# EAGLE design power_board_pcie (EAGLE 9.1.3)
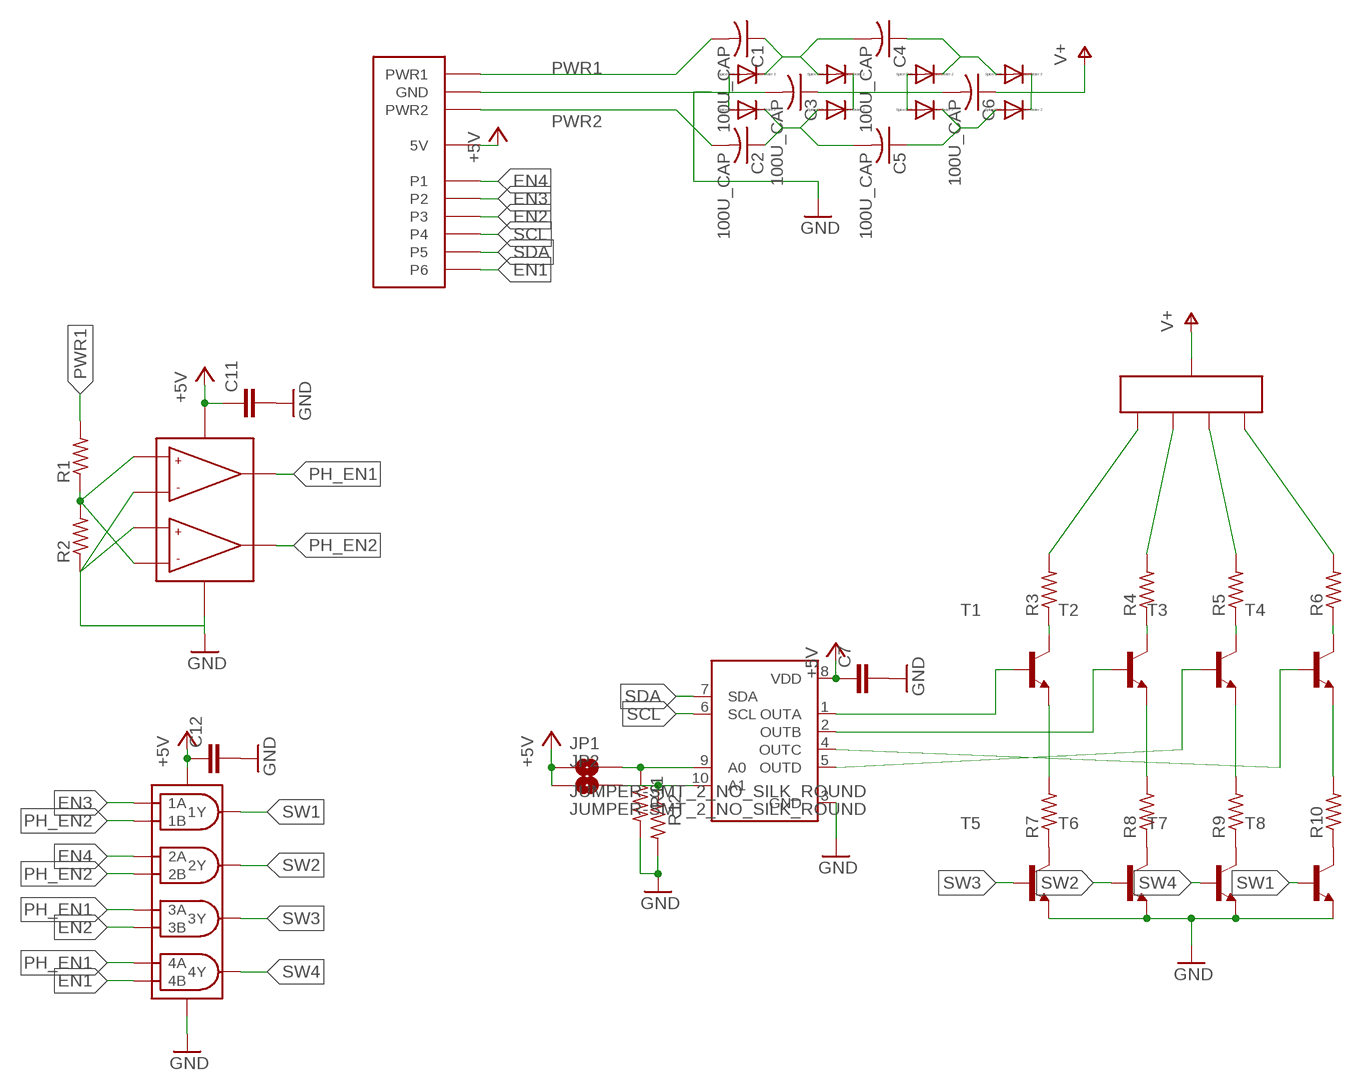
[diagram p0: schematic, sheet 1]

## Parts
C1  100U_CAP  [100U_CAP]
C2  100U_CAP  [100U_CAP]
C3  100U_CAP  [100U_CAP]
C4  100U_CAP  [100U_CAP]
C5  100U_CAP  [100U_CAP]
C6  100U_CAP  [100U_CAP]
C7  C-EUC1206  [C1206]
C11  C-EUC1206  [C1206]
C12  C-EUC1206  [C1206]
D1  BAS16GW  [SOD3616X130]
D2  BAS16GW  [SOD3616X130]
D3  BAS16GW  [SOD3616X130]
D4  BAS16GW  [SOD3616X130]
D5  BAS16GW  [SOD3616X130]
D6  BAS16GW  [SOD3616X130]
D7  BAS16GW  [SOD3616X130]
D8  BAS16GW  [SOD3616X130]
J1  PCIE_EDGE  [PCIE_EDGE]
JP1  JUMPER-SMT_2_NO_SILK_ROUND  [SMT-JUMPER_2_NO_SILK_ROUND]
JP2  JUMPER-SMT_2_NO_SILK_ROUND  [SMT-JUMPER_2_NO_SILK_ROUND]
R1  R-US_R1206  [R1206]
R2  R-US_R1206  [R1206]
R3  R-US_R1206  [R1206]
R4  R-US_R1206  [R1206]
R5  R-US_R1206  [R1206]
R6  R-US_R1206  [R1206]
R7  R-US_R1206  [R1206]
R8  R-US_R1206  [R1206]
R9  R-US_R1206  [R1206]
R10  R-US_R1206  [R1206]
R11  R-US_R0603  [R0603]
R12  R-US_R0603  [R0603]
T1  -NPN-SOT23-EBC  [SOT23-EBC]
T2  -NPN-SOT23-EBC  [SOT23-EBC]
T3  -NPN-SOT23-EBC  [SOT23-EBC]
T4  -NPN-SOT23-EBC  [SOT23-EBC]
T5  -NPN-SOT23-EBC  [SOT23-EBC]
T6  -NPN-SOT23-EBC  [SOT23-EBC]
T7  -NPN-SOT23-EBC  [SOT23-EBC]
T8  -NPN-SOT23-EBC  [SOT23-EBC]
U1  74HCT08D  [SOIC127P600X175-14]
U2  DAC5574  [SOP50P490X110-10]
U3  AZ4558CMTR-G1  [SOIC127P600X175-8]
U$3  POWER_EDGE  [POWER_EDGE]

## Nets
+5V: C7.1 C11.1 C12.1 J1.PWR3(5V) J1.PWR3_2(5V) JP1.1 JP2.1 U1.14(VCC) U2.8(VDD) U3.8(VCC)
EN1: J1.P6 U1.13(4B)
EN2: J1.P3 U1.10(3B)
EN3: J1.P2 U1.1(1A)
EN4: J1.P1 U1.4(2A)
GND: C3.C C7.2 C11.2 C12.2 D1.2(A) D2.2(A) J1.P$2(GND) J1.P$5(GND) R2.1 R11.2 R12.2 T5.E T6.E T7.E T8.E U1.7(GND) U2.3(GND) U3.2(IN1-) U3.4(VEE) U3.5(IN2+)
N$1: R7.2 T1.E
N$2: R1.1 R2.2 U3.3(IN1+) U3.6(IN2-)
N$3: R3.1 T1.C
N$4: C3.A C6.C D3.1(C) D4.1(C) D5.2(A) D6.2(A)
N$5: C1.A C4.C D1.1(C) D3.2(A)
N$6: C2.A C5.C D2.1(C) D4.2(A)
N$7: C4.A D5.1(C) D7.2(A)
N$8: C5.A D6.1(C) D8.2(A)
N$9: R3.2 U$3.C1
N$10: R4.2 U$3.C2
N$11: R5.2 U$3.C3
N$12: R4.1 T2.C
N$13: R6.2 U$3.C4
N$16: R5.1 T3.C
N$18: R6.1 T4.C
N$19: R7.1 T5.C
N$20: T2.B U2.2(OUTB)
N$21: T3.B U2.5(OUTD)
N$22: T4.B U2.4(OUTC)
N$23: T1.B U2.1(OUTA)
N$24: R8.2 T2.E
N$25: R9.2 T3.E
N$26: R10.2 T4.E
N$27: R8.1 T6.C
N$28: R9.1 T7.C
N$29: R10.1 T8.C
N$32: JP1.2 R11.1 U2.9(A0)
N$33: JP2.2 R12.1 U2.10(A1)
PH_EN1: U1.9(3A) U1.12(4A) U3.1(OUT1)
PH_EN2: U1.2(1B) U1.5(2B) U3.7(OUT2)
PWR1: C1.C J1.P$1(PWR1) J1.P$4(PWR1) R1.2
PWR2: C2.C J1.P$3(PWR2) J1.P$6(PWR2)
SCL: J1.P4 U2.6(SCL)
SDA: J1.P5 U2.7(SDA)
SW1: T8.B U1.3(1Y)
SW2: T6.B U1.6(2Y)
SW3: T5.B U1.8(3Y)
SW4: T7.B U1.11(4Y)
V+: C6.A D7.1(C) D8.1(C) U$3.A1(A) U$3.A2(A) U$3.A3(A) U$3.A4(A)

## Library data of the parts
C1-C6 = tide_clock:100U_CAP
C7 C11 C12 = resistor:C-EU: CAPACITOR, European symbol
D1-D8 = tide_clock:BAS16GW
J1 = tide_clock:PCIE_EDGE
JP1 JP2 = SparkFun-Jumpers:JUMPER-SMT_2_NO: Normally open jumper This jumper has two pads in close proximity to each other. Apply solder to close the connection. Round pads are easier to solder for beginners, but are a lot larger. SparkFun Product that uses the round pads: SparkFun EL Sequencer <https://www.sparkfun.com/products/12781>
R1-R12 = resistor:R-US_: RESISTOR, American symbol
T1-T8 = transistor:*-NPN-: NPN Transistror BF959 corrected 2008.03.06
U1 = tide_clock:74HCT08D
U2 = tide_clock:DAC5574
U3 = tide_clock:AZ4558CMTR-G1
U$3 = tide_clock:POWER_EDGE

## Board
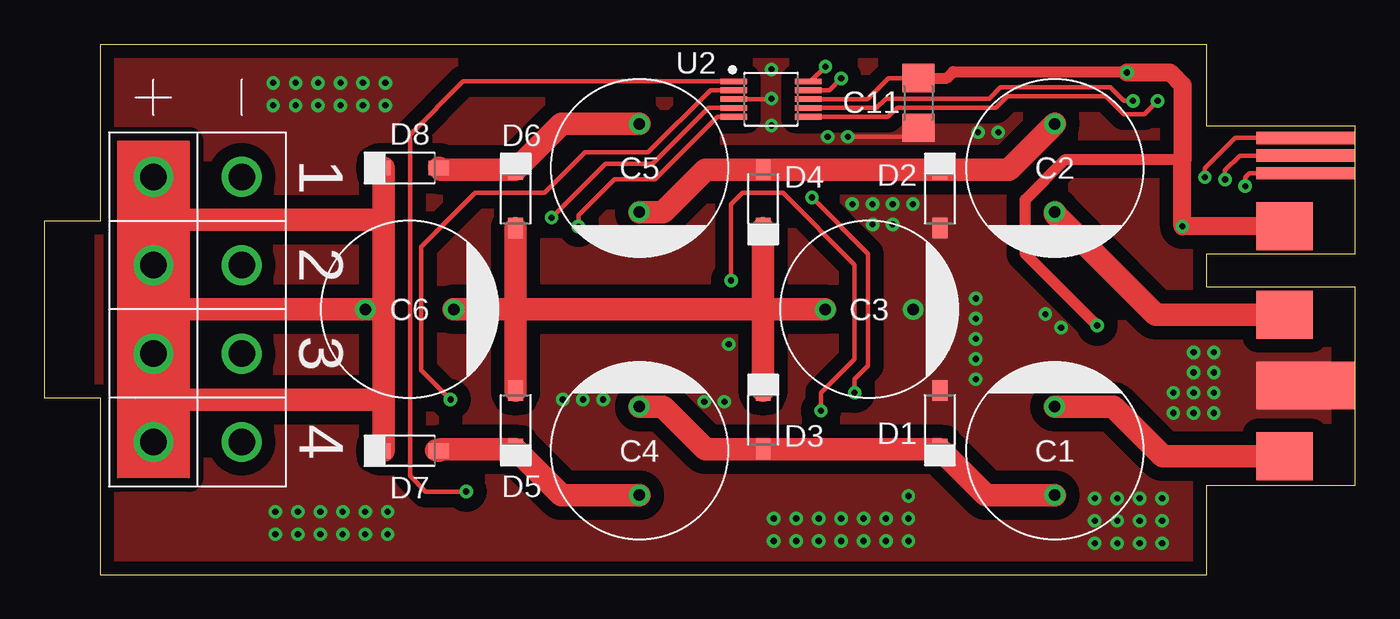
[diagram p1: board, top side]
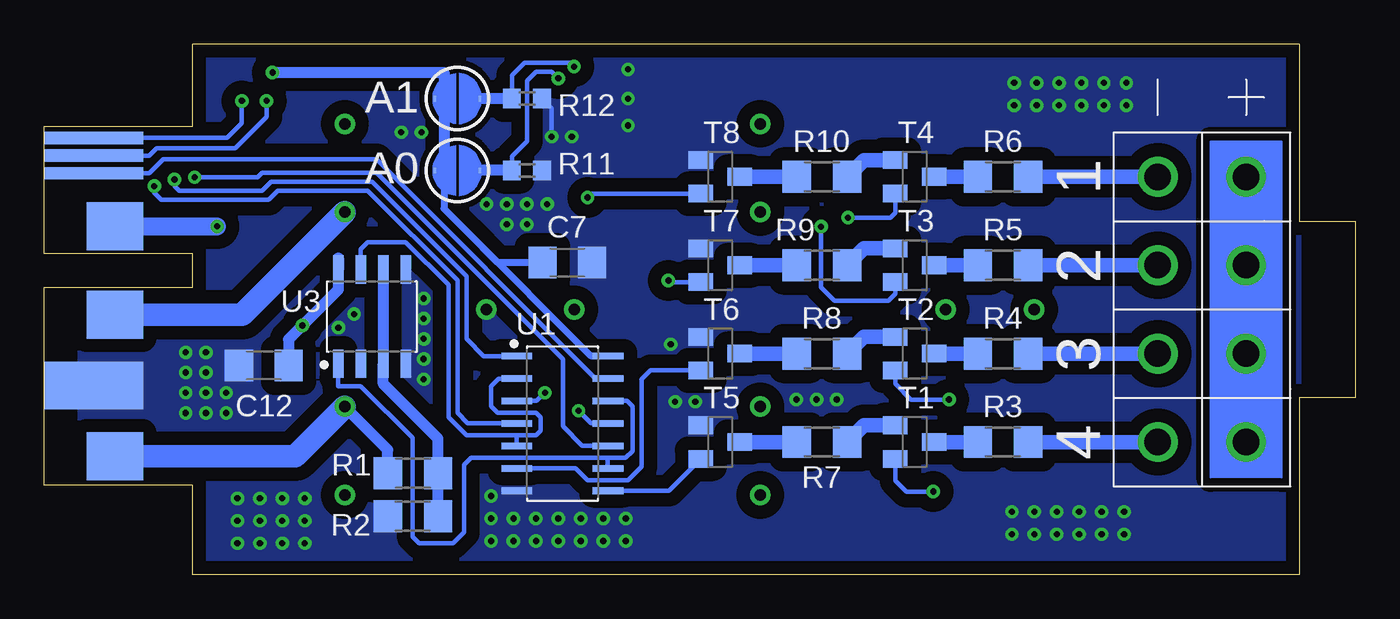
[diagram p2: board, bottom side, seen from below]

Size 74.17 x 30 mm. Coordinates in mm from the lower left corner, seen from the top.
Outline: 3.17,30 65.78,30 65.78,25.35 74.17,25.35 74.17,18.15 65.78,18.15 65.78,16.25 74.17,16.25 74.17,5.05 65.78,5.05 65.78,0 3.17,0 3.17,10 0,10 0,20 3.17,20 3.17,30
Copper layers (1*16): Top 0.035mm / dielectric 1.5mm / Bottom 0.035mm
Design rules "default *": minimum track width 6mil, minimum drill 0.35mm, track to track 6mil, track to pad 6mil, pad to pad 6mil, via to via 6mil, smd to smd 6mil, copper to edge 30mil, drill to drill 6mil, minimum pad ring 10mil, minimum via ring 8mil, stop-mask expansion 4mil, vias tented up to drill 20mil, thermal gap 10mil

### Footprints (pad centres in the part's own frame; a part is rotated, then mirrored left to right if it is on the bottom)
100U_CAP = drill 0.65: A 0,2.5; C 0,-2.5
C1206 = smd 1.6 x 1.8: 1 -1.4,0; 2 1.4,0
SOD3616X130 = smd 1.159 x 0.839: 1 -1.656,0; 2 1.656,0
PCIE_EDGE = smd 0.7 x 5.6: P1 22.7,-5.6; P2 23.7,-5.6; P3 24.7,-5.6 | smd 0.7 x 5.6 bottom: P4 24.7,-5.6; P5 23.7,-5.6; P6 22.7,-5.6 | smd 2.7 x 3.2: P$1 6.7,-4.4; P$3 14.7,-4.4; PWR3 19.7,-4.4 | smd 2.7 x 5.6: P$2 10.7,-5.6 | smd 2.7 x 3.2 bottom: P$4 6.7,-4.4; P$6 14.7,-4.4; PWR3_2 19.7,-4.4 | smd 2.7 x 5.6 bottom: P$5 10.7,-5.6
SMT-JUMPER_2_NO_SILK_ROUND = smd 0.152 x 0.305: 1 -1.27,0; 2 1.27,0
R1206 = smd 1.6 x 1.803: 1 -1.422,0; 2 1.422,0
R0603 = smd 1 x 1.1: 1 -0.85,0; 2 0.85,0
SOT23-EBC = smd 1 x 1.4: B 0.95,-1.1; C 0,1.1; E -0.95,-1.1
SOIC127P600X175-14 = smd 1.746 x 0.377: 1 -2.585,3.81; 2 -2.585,2.54; 3 -2.585,1.27; 4 -2.585,0; 5 -2.585,-1.27; 6 -2.585,-2.54; 7 -2.585,-3.81; 8 2.585,-3.81; 9 2.585,-2.54; 10 2.585,-1.27; 11 2.585,0; 12 2.585,1.27; 13 2.585,2.54; 14 2.585,3.81
SOP50P490X110-10 = smd 1.503 x 0.322: 1 -2.104,1; 2 -2.104,0.5; 3 -2.104,0; 4 -2.104,-0.5; 5 -2.104,-1; 6 2.104,-1; 7 2.104,-0.5; 8 2.104,0; 9 2.104,0.5; 10 2.104,1
SOIC127P600X175-8 = smd 1.597 x 0.602: 1 -2.659,1.905; 2 -2.659,0.635; 3 -2.659,-0.635; 4 -2.659,-1.905; 5 2.659,-1.905; 6 2.659,-0.635; 7 2.659,0.635; 8 2.659,1.905
POWER_EDGE = drill 1.5: A1 3,7.5; A2 3,12.5; A3 3,17.5; A4 3,22.5; C1 8,7.5; C2 8,12.5; C3 8,17.5; C4 8,22.5

### Placement (x,y rotation side)
C1  57.17,7 180 top
C2  57.17,23 0 top
C3  46.67,15 90 top
C4  33.67,7 180 top
C5  33.67,23 0 top
C6  20.68,15 90 top
C7  44.58,17.65 0 bottom
C11  49.45,26.68 270 top
C12  61.75,11.83 180 bottom
D1  50.67,8.75 90 top
D2  50.67,21.25 270 top
D3  40.67,8.75 270 top
D4  40.67,21.25 90 top
D5  26.68,8.75 90 top
D6  26.68,21.25 270 top
D7  20.68,7 0 top
D8  20.68,23 0 top
J1  65.78,0 90 top
JP1  50.8,22.86 0 bottom
JP2  50.8,26.92 0 bottom
R1  53.31,5.74 180 bottom
R2  53.31,3.3 0 bottom
R3  19.93,7.5 0 bottom
R4  19.93,12.5 0 bottom
R5  19.93,17.5 0 bottom
R6  19.93,22.5 0 bottom
R7  30.18,7.5 0 bottom
R8  30.18,12.5 0 bottom
R9  30.18,17.5 0 bottom
R10  30.18,22.5 0 bottom
R11  46.86,22.86 0 bottom
R12  46.86,26.92 0 bottom
T1  24.93,7.5 270 bottom
T2  24.93,12.5 270 bottom
T3  24.93,17.5 270 bottom
T4  24.93,22.5 270 bottom
T5  35.92,7.5 270 bottom
T6  35.92,12.5 270 bottom
T7  35.92,17.5 270 bottom
T8  35.92,22.5 270 bottom
U1  44.85,8.55 0 bottom
U2  41.12,26.89 0 top
U3  55.63,14.59 90 bottom
U$3  3.17,0 0 top

### Tracks (layer width: path | path; a pad name or v marks a point on that pad's centre or on a via)
+5V  (via drill 0.35)
  Top 0.254: U2.8 46.58,26.89 47.77,28.08 C11.1 | 61.21,28.45 v61.26,28.4
  Top 0.61: C11.1 51.07,28.08 51.44,28.45 61.21,28.45 | v59.56,14.1 55.5,18.16 55.5,21.21 57.78,23.49 64.39,23.49
  Top 1.016: v61.26,28.4 63.67,28.4 64.39,27.68 64.39,24.75 64.39,24.68 64.39,23.49 v64.39,19.7 J1.PWR3_2
  Bottom 0.254: JP1.1 51.69,22.86 51.56,22.73 | JP2.1 51.56,26.92
  Bottom 0.406: U1.14 43.23,12.36 50.23,19.37 | C7.1 48.51,17.65 50.23,19.37 | 50.23,19.37 51.56,20.7 51.56,22.73
  Bottom 0.61: C12.1 60.35,13.31 v59.56,14.1 57.53,16.13 57.53,17.91 U3.8 | v61.26,28.4 51.56,28.4 51.56,26.92 51.56,22.73
  Bottom 1.016: J1.PWR3_2 v64.39,19.7
EN1
  Bottom 0.254: U1.13 42.97,11.09 55.37,23.5 67.44,23.5 68.23,22.7 J1.P6
EN2  (via drill 0.35)
  Top 0.254: v65.66,22.48 65.66,22.99 67.37,24.7 J1.P3
  Bottom 0.254: U1.10 43.73,7.28 44.83,8.38 44.83,12.19 55.37,22.73 61.85,22.73 62.1,22.48 v65.66,22.48
EN3  (via drill 0.35)
  Top 0.254: v66.8,22.35 66.8,22.86 67.64,23.7 J1.P2
  Bottom 0.254: U1.1 49.32,12.36 50.29,13.34 50.29,16.89 55.63,22.23 61.34,22.23 61.85,21.72 65.28,21.72 66.55,21.72 66.8,21.97 v66.8,22.35
EN4  (via drill 0.35)
  Top 0.254: J1.P1 68.17,22.7 67.94,22.48 v67.94,21.97
  Bottom 0.254: U1.4 50.21,8.55 50.8,9.14 50.8,16.64 55.88,21.72 60.96,21.72 61.47,21.21 64.26,21.21 67.56,21.21 67.94,21.59 v67.94,21.97
GND  (via drill 0.35)
  Top 0.254: U2.3 40.92,26.89 41.02,26.8 | C11.2 49.45,24.77 v45.47,24.77
  Bottom 0.254: v45.47,24.77 45.47,26.38 R12.2
  other vias: 41.15,28.57 41.15,26.92 41.15,25.4 44.32,24.77 52.83,25.02 53.98,25.02 59.44,4.32 60.71,4.32 61.98,4.32 63.25,4.32 59.44,3.05 60.71,3.05 61.98,3.05 63.25,3.05 59.44,1.78 60.71,1.78 61.98,1.78 63.25,1.78 56.64,14.73 57.53,13.97 52.7,15.62 52.7,14.48 52.7,13.34 65.02,12.57 66.17,12.57 65.02,11.43 66.17,11.43 65.02,10.29 66.17,10.29 65.02,9.14 66.17,9.14 45.72,20.95 46.86,20.95 48.01,20.95 49.15,20.95 46.86,19.81 48.01,19.81 37.34,9.78 38.48,9.78 31.62,9.91 30.48,9.91 29.34,9.91 48.9,4.45 48.9,3.17 48.9,1.91 47.62,1.91 47.62,3.17 46.35,3.17 46.35,1.91 45.09,1.91 45.09,3.17 43.81,3.17 43.81,1.91 42.55,3.17 42.55,1.91 41.27,1.91 41.27,3.17 19.3,26.54 19.3,27.81 18.03,27.81 18.03,26.54 16.76,26.54 16.76,27.81 15.49,27.81 15.49,26.54 14.22,27.81 14.22,26.54 12.95,26.54 12.95,27.81 52.7,12.19 52.7,11.05 19.43,2.29 19.43,3.56 18.16,3.56 18.16,2.29 16.89,2.29 16.89,3.56 15.62,3.56 15.62,2.29 14.35,3.56 14.35,2.29 13.08,2.29 13.08,3.56 38.73,13.03 63.88,9.14 63.88,10.29
  pour Bottom (isolate 0.762, rank 3, no thermals): 3.17,30 66.17,30 66.17,25 66.17,16 72.17,16 72.17,5 66.17,5 66.17,0 3.17,0
  pour Top (isolate 0.762, no thermals): 3.17,30.23 65.66,30.23 65.66,16 72.52,16 72.52,5.08 65.66,5.08 65.66,0 3.17,0
N$1
  Bottom 0.813: T1.E 27.8,8.45 R7.2
N$2
  Bottom 0.61: U3.6 U3.3 54.99,10.8 51.89,7.7 R1.1 R2.2
N$3
  Bottom 0.813: R3.1 T1.C
N$4
  Top 1.27: C3.A 40.77,15 40.67,15 | 40.67,15 26.68,15 | C6.C 26.54,15 26.68,15 | D4.1 40.67,15 | D3.1 40.67,15 | D6.2 26.68,15 | D5.2 26.68,15
N$5
  Top 1.27: C1.A 53.27,4.5 D1.1 D3.2 37.41,7.09 35,9.5 C4.C
N$6
  Top 1.27: C2.A 54.58,22.91 D2.1 D4.2 37.41,22.91 35,20.5 C5.C
N$7
  Top 1.27: 22.18,7.04 D7.2 22.43,7.09 D5.1 29.27,4.5 C4.A
N$8
  Top 1.27: D8.2 22.43,22.91 D6.1 29.27,25.5 C5.A
N$9
  Bottom 0.813: U$3.C1 R3.2
N$10
  Bottom 0.813: U$3.C2 R4.2
N$11
  Bottom 0.813: U$3.C3 R5.2
N$12
  Bottom 0.813: R4.1 T2.C
N$13
  Bottom 0.813: U$3.C4 R6.2
N$16
  Bottom 0.813: R5.1 T3.C
N$18
  Bottom 0.813: R6.1 T4.C
N$19
  Bottom 0.813: R7.1 T5.C
N$20  (via drill 0.35)
  Top 0.254: U2.2 37.68,27.39 34.16,23.88 30.61,23.88 28.32,21.59 24.38,21.59 21.34,18.54 21.34,11.56 v22.99,9.91
  Bottom 0.254: v22.99,9.91 25.15,9.91 26.02,10.79 T2.B
N$21  (via drill 0.35)
  Top 0.254: U2.5 38.09,25.89 34.54,22.35 32.26,22.35 30.23,20.32 v30.23,19.68
  Bottom 0.254: v30.23,19.68 30.23,16.26 29.46,15.49 26.42,15.49 26.02,15.88 T3.B
N$22  (via drill 0.35)
  Top 0.254: U2.4 37.57,26.39 34.42,23.24 31.75,23.24 v28.7,20.19
  Bottom 0.254: v28.7,20.19 26.29,20.19 26.02,20.46 T4.B
N$23  (via drill 0.35)
  Top 0.254: U2.1 23.7,27.89 20.7,24.89 20.7,5.59 21.59,4.7 v23.88,4.7
  Bottom 0.254: v23.88,4.7 25.4,4.7 26.02,5.32 T1.B
N$24
  Bottom 0.813: T2.E 27.8,13.45 R8.2
N$25
  Bottom 0.813: T3.E 27.8,18.45 R9.2
N$26
  Bottom 0.813: T4.E 27.8,23.45 R10.2
N$27
  Bottom 0.813: R8.1 T6.C
N$28
  Bottom 0.813: R9.1 T7.C
N$29
  Bottom 0.813: R10.1 T8.C
N$32  (via drill 0.35)
  Top 0.254: U2.9 44.41,27.39 v45.09,28.07
  Bottom 0.254: v45.09,28.07 45.47,28.45 46.35,28.45 46.86,27.94 46.86,24.51 47.71,23.66 R11.1
  Bottom 0.61: R11.1 JP1.2
N$33  (via drill 0.35)
  Top 0.254: v44.2,28.73 43.36,27.89 U2.10
  Bottom 0.254: R12.1 47.71,28.23 46.99,28.96 44.42,28.96 v44.2,28.73
  Bottom 0.61: R12.1 JP2.2
PH_EN1
  Bottom 0.254: U3.1 57.53,10.67 56.26,10.67 53.34,7.75 53.34,2.16 52.96,1.78 51.05,1.78 50.42,2.41 50.42,6.22 50.04,6.6 42.29,6.6 | U1.12 41.19,9.82 40.89,9.53 40.89,6.99 41.27,6.6 42.29,6.6 | U1.9 42.29,6.04 42.29,6.6
PH_EN2
  Bottom 0.254: U3.7 56.26,18.41 55.88,18.8 53.72,18.8 51.31,16.38 51.31,8.89 50.29,7.87 47.5,7.87 | 47.5,7.87 46.35,7.87 46.1,8.13 46.1,8.89 46.35,9.14 48.51,9.14 48.9,9.53 48.9,10.67 48.47,11.09 U1.2 | U1.5 47.44,7.82 47.5,7.87
PWR1
  Top 1.27: J1.P$1 63.28,6.7 60.48,9.5 C1.C
  Bottom 0.61: R1.2 54.74,7.06 C1.C
  Bottom 1.27: C1.C 59.98,6.7 J1.P$1
PWR2
  Top 1.27: J1.P$3 62.9,14.7 57.17,20.42 C2.C
  Bottom 1.27: C2.C 62.98,14.7 J1.P$3
SCL  (via drill 0.35)
  Top 0.254: U2.6 47.74,25.89 48.26,26.42 53.85,26.42 54.48,27.05 60.07,27.05 61.09,26.04 62.23,26.04 v62.99,26.8
  Bottom 0.254: v62.99,26.8 62.99,25.53 63.82,24.7 J1.P4
SDA  (via drill 0.35)
  Top 0.254: U2.7 47.1,26.39 47.62,26.92 53.47,26.92 54.1,27.56 60.33,27.56 61.09,26.8 v61.59,26.8
  Bottom 0.254: v61.59,26.8 61.59,25.91 63.37,24.13 67.82,24.13 68.25,23.7 J1.P5
SW1  (via drill 0.35)
  Top 0.254: v43.43,21.34 46.61,18.16 46.61,11.81 45.85,11.05 v45.85,10.29
  Bottom 0.254: U1.3 46.31,9.82 v45.85,10.29 | v43.43,21.34 43.22,21.55 T8.B
SW2
  Bottom 0.254: U1.6 44.11,6.01 43.43,5.33 41.15,5.33 40.39,6.1 40.39,11.05 39.88,11.55 T6.B
SW3
  Bottom 0.254: T5.B 38.83,4.74 U1.8
SW4  (via drill 0.35)
  Top 0.254: v43.94,9.27 43.94,10.29 45.85,12.19 45.85,17.53 41.78,21.59 39.5,21.59 38.86,20.95 v38.86,16.64
  Bottom 0.254: U1.11 43.23,8.55 v43.94,9.27 | v38.86,16.64 38.77,16.55 T7.B
V+
  Top 1.27: 19.21,20.07 19.21,15 | 19.21,15 C6.A 6.17,15 | 19.21,9.91 19.21,15 | 6.17,15 U$3.A3 6.17,20.07 | 6.17,15 U$3.A2 6.17,9.91 | 6.17,9.91 U$3.A1 | 6.17,20.07 U$3.A4 | 6.17,20.07 19.21,20.07 | 6.17,9.91 19.21,9.91 | 19.21,20.07 19.21,23 D8.1 | 19.21,9.91 19.21,7 D7.1

### Text on the board
bPlace: A1 | A0